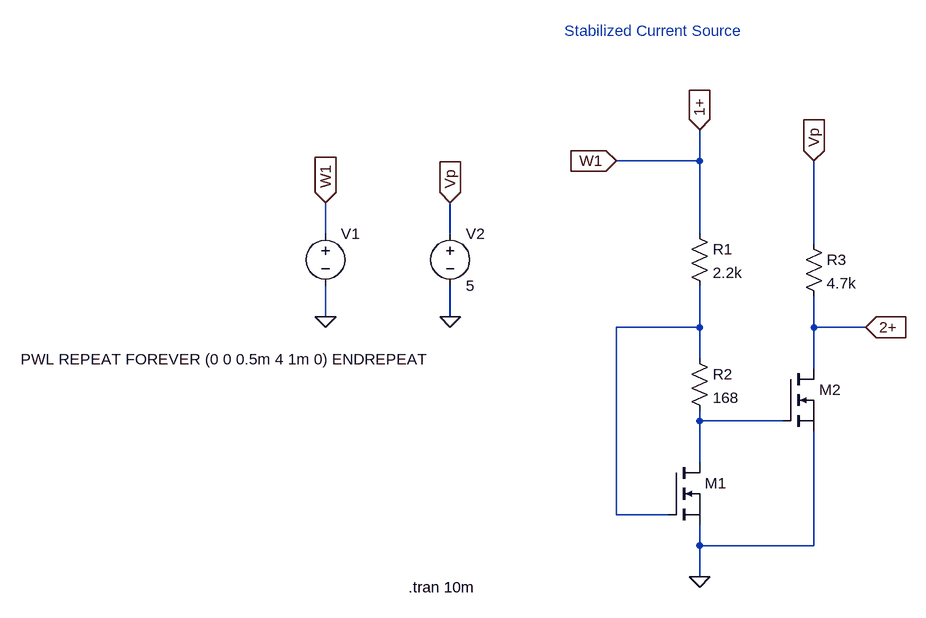
[diagram p0: schematic mos_stab_curr_source_ltspice.asc]
mos_stab_curr_source_ltspice.asc, the LTspice schematic file:
Version 4
SHEET 1 1104 680
WIRE 80 -400 80 -448
WIRE 80 -400 -48 -400
WIRE -496 -288 -496 -336
WIRE -304 -288 -304 -336
WIRE 80 -288 80 -400
WIRE 256 -272 256 -400
WIRE -496 -160 -496 -208
WIRE -304 -160 -304 -208
WIRE 80 -144 80 -208
WIRE 80 -144 -48 -144
WIRE 256 -144 256 -192
WIRE 336 -144 256 -144
WIRE 80 -96 80 -144
WIRE 256 -80 256 -144
WIRE 80 0 80 -16
WIRE 208 0 80 0
WIRE 80 64 80 0
WIRE -48 144 -48 -144
WIRE 32 144 -48 144
WIRE 80 192 80 160
WIRE 256 192 256 16
WIRE 256 192 80 192
WIRE 80 240 80 192
FLAG 80 240 0
FLAG -48 -400 W1
IOPIN -48 -400 In
FLAG -496 -160 0
FLAG -496 -336 W1
IOPIN -496 -336 In
FLAG 256 -400 Vp
IOPIN 256 -400 In
FLAG -304 -160 0
FLAG -304 -336 Vp
IOPIN -304 -336 In
FLAG 80 -448 1+
IOPIN 80 -448 In
FLAG 336 -144 2+
IOPIN 336 -144 In
SYMBOL res 64 -304 R0
SYMATTR InstName R1
SYMATTR Value 2.2k
SYMBOL res 64 -112 R0
SYMATTR InstName R2
SYMATTR Value 168
SYMBOL voltage -496 -304 R0
WINDOW 3 -469 209 Left 2
SYMATTR Value PWL REPEAT FOREVER (0 0 0.5m 4 1m 0) ENDREPEAT
SYMATTR InstName V1
SYMBOL res 240 -288 R0
SYMATTR InstName R3
SYMATTR Value 4.7k
SYMBOL voltage -304 -304 R0
WINDOW 123 0 0 Left 0
WINDOW 39 0 0 Left 0
SYMATTR InstName V2
SYMATTR Value 5
SYMBOL nmos 32 64 R0
WINDOW 3 56 72 Invisible 2
SYMATTR Value BSP89
SYMATTR InstName M1
SYMBOL nmos 208 -80 R0
WINDOW 3 56 72 Invisible 2
SYMATTR Value BSP89
SYMATTR InstName M2
TEXT -368 256 Left 2 !.tran 10m
TEXT -128 -600 Left 2 ;Stabilized Current Source

The netlist it stands for:
* mos_stab_curr_source_ltspice.asc
R1 1+ N001 2.2k
R2 N001 N002 168
V1 1+ 0 PWL REPEAT FOREVER (0 0 0.5m 4 1m 0) ENDREPEAT
R3 Vp 2+ 4.7k
V2 Vp 0 5
M1 N002 N001 0 0 BSP89
M2 2+ N002 0 0 BSP89
.model NMOS NMOS
.model PMOS PMOS
.lib standard.mos
.tran 10m
* Stabilized Current Source
.backanno
.end